# EAGLE design Plytka obw_wyjsciowych (EAGLE 4.11)
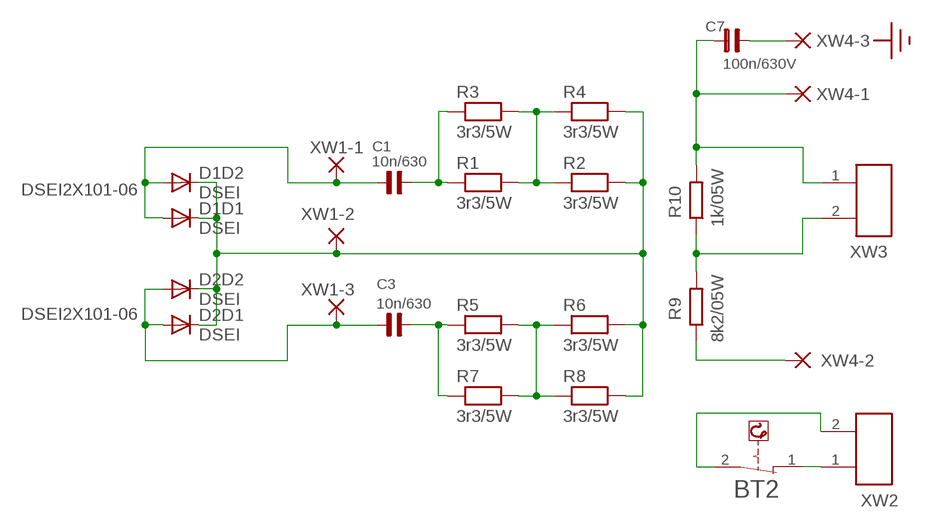
[diagram p0: schematic, sheet 1]

## Parts
BT2  TGRENZ  [TGRENZ]
C1  10n/630  C7,5B6  [C7,5B6]
C3  10n/630  C7,5B6  [C7,5B6]
C7  100n/630V  C27,5B9  [C27,5B9]
D1  DSEI  [SOT227]
D2  DSEI  [SOT227]
R1  3r3/5W  RPOWER5W  [RPOWER5W]
R2  3r3/5W  RPOWER5W  [RPOWER5W]
R3  3r3/5W  RPOWER5W  [RPOWER5W]
R4  3r3/5W  RPOWER5W  [RPOWER5W]
R5  3r3/5W  RPOWER5W  [RPOWER5W]
R6  3r3/5W  RPOWER5W  [RPOWER5W]
R7  3r3/5W  RPOWER5W  [RPOWER5W]
R8  3r3/5W  RPOWER5W  [RPOWER5W]
R9  8k2/05W  R-EU_0309/12  [0309/12]
R10  1k/05W  R-EU_0309/12  [0309/12]
XW1-1  PAD-0820  [0820]
XW1-2  PAD-0820  [0820]
XW1-3  PAD-0820  [0820]
XW2  ZK_2  [ZK_2]
XW3  ZK_2  [ZK_2]
XW4-1  PAD-0820  [0820]
XW4-2  PAD-0820  [0820]
XW4-3  PAD-0820  [0820]

## Nets
N$1: R1.2 R2.1 R3.2 R4.1
N$2: R5.2 R6.1 R7.2 R8.1
N$3: C1.2 R1.1 R3.1
N$5: C3.2 R5.1 R7.1
N$11: R9.1 XW4-2.P$1(P)
N$12: C7.1 R10.2 XW3.1 XW4-1.P$1(P)
N$13: C7.2 XW4-3.P$1(P)
N$14: BT2.1 XW2.1
N$15: R9.2 R10.1 XW3.2
N$16: BT2.2 XW2.2
N$20: C1.1 D1.A1(D1:A) D1.A2(D2:A) XW1-1.P$1(P)
N$21: C3.1 D2.A1(D1:A) D2.A2(D2:A) XW1-3.P$1(P)
QQQ: D1.K1(D1:C) D1.K2(D2:C) D2.K1(D1:C) D2.K2(D2:C) R2.2 R4.2 R6.2 R8.2 XW1-2.P$1(P)

## Notes on the sheet
- DSEI2X101-06
- DSEI2X101-06

## Library data of the parts
BT2 = ELEKTRIK:TGRENZ
C1 C3 = condensatory_2:C7,5B6
C7 = condensatory_2:C27,5B9
D1 D2 = diode:DSEI
R1-R8 = moje-elementy:RPOWER5W
R9 R10 = rcl:R-EU_: RESISTOR, European symbol
XW1-1-XW1-3 XW4-1-XW4-3 = dpads:PAD: WIRE PAD Standard US Drill Sizes and SMD pads
XW2 XW3 = moje-elementy:ZK_2

## Board
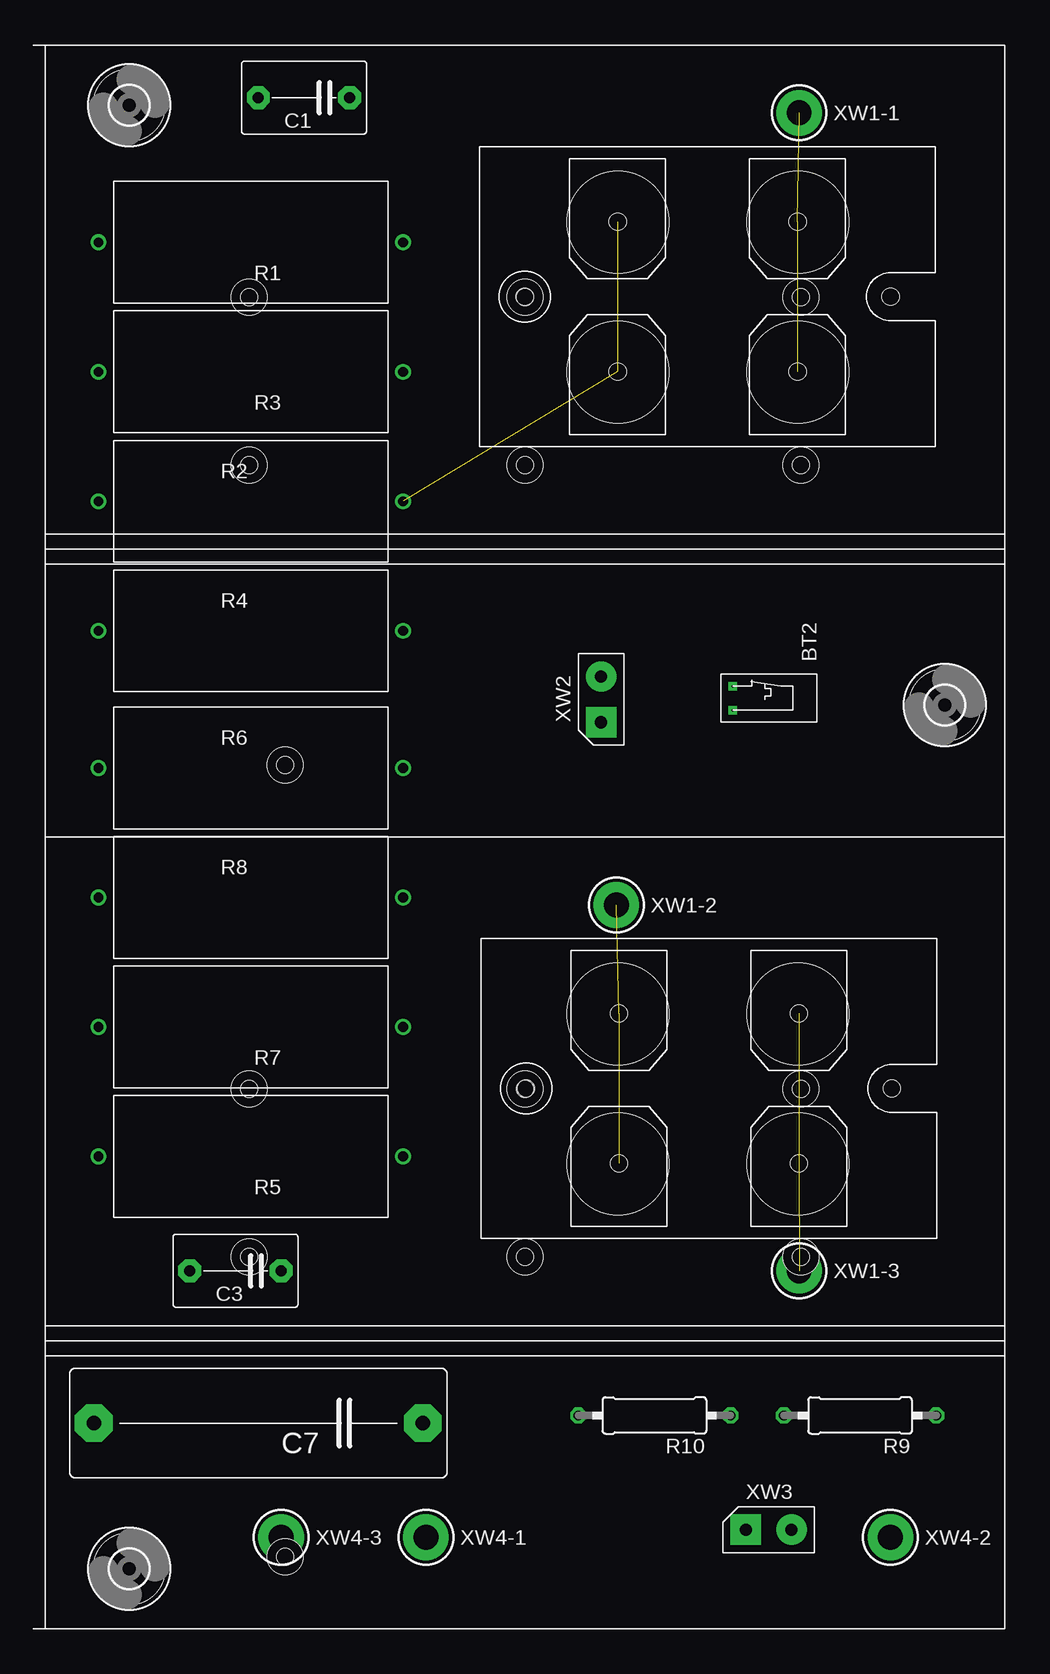
[diagram p1: board, top side]
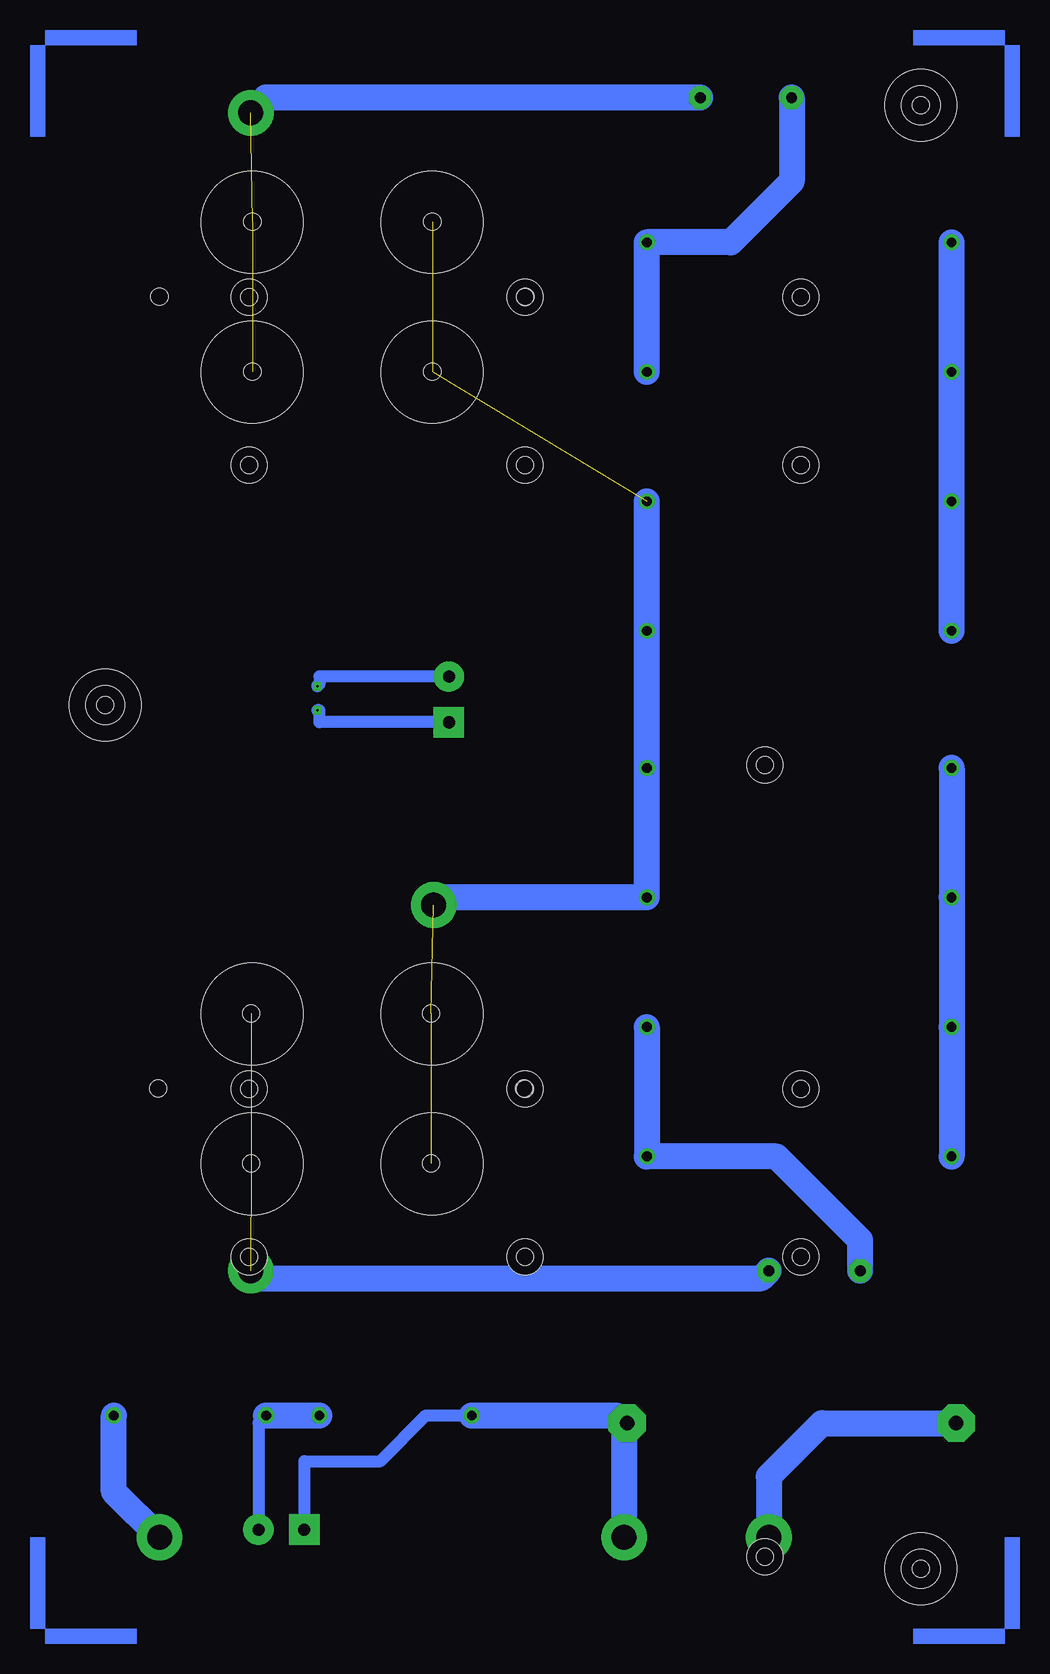
[diagram p2: board, bottom side, seen from below]

No outline drawn. Coordinates in mm, seen from the top.
Copper layers (1*16): Top 0.035mm / dielectric 1.5mm / Bottom 0.035mm
Design rules "default": minimum track width 10mil, minimum drill 24mil, track to track 8mil, track to pad 8mil, pad to pad 8mil, via to via 8mil, smd to smd 8mil, copper to edge 40mil, drill to drill 8mil, minimum pad ring 10mil, minimum via ring 8mil, stop-mask expansion 4mil, vias tented up to drill 0mil, thermal gap 10mil
Holes 8.5 mm at -32.25,117.25 -17.25,117.25 -32.25,104.75 -17.25,104.75 -32.25,51.25 -17.25,51.25 -32.25,38.75 -17.25,38.75
Holes 6 mm at -73,127 -73,5 -5,77
Holes 1.42 mm at -73,5 -5,77 -73,127

### Footprints (pad centres in the part's own frame; a part is rotated, then mirrored left to right if it is on the bottom)
TGRENZ = drill 0.2 pad 0.4 square: 1 1,3; 2 3,3
C7,5B6 = drill 0.914 pad 1.905 octagon: 1 -3.81,0; 2 3.81,0
C27,5B9 = drill 1.194 pad 3.15 octagon: 1 -13.716,0; 2 13.716,0
SOT227 = drill 4 round: A1 -7.5,-6.25; A2 -7.5,6.25; K1 7.5,-6.25; K2 7.5,6.25 | hole 1.422: 15.25,0; -15.25,0; -7.5,-6.25; -7.5,6.25; 7.5,6.25; 7.5,-6.25
RPOWER5W = drill 0.813 round: 1 -12.7,0; 2 12.7,0
0309/12 = drill 0.813 octagon: 1 -6.35,0; 2 6.35,0
RAD80X66 = hole 1.422: -17,21; -17,35; -40,21; -40,35; -63,21; -63,35; -20,60 | hole 3: -17,35; -17,21; -40,21; -63,21; -63,35; -40,35; -20,60
3,2 = hole 3.2: 0,0
0820 = drill 2.083 pad 3.81 round: P$1 0,0
ZK_2 = drill 1.016 pad 2.54 square: 1 -3.81,0 | drill 1.016 pad 2.54 round: 2 0,0

### Placement (x,y rotation side)
BT2  -19.68,75.56 90 top
C1  -58.42,127.64 180 top
C3  -64.14,29.84 180 top
C7  -62.23,17.14 180 top
D1  -24.78,111.04 180 top
D2  -24.66,45.04 180 top
R1  -62.87,115.57 180 top
R2  -62.87,93.98 0 top
R3  -62.87,104.78 180 top
R4  -62.87,83.19 0 top
R5  -62.87,39.37 180 top
R6  -62.87,71.75 0 top
R7  -62.87,50.16 180 top
R8  -62.87,60.96 0 top
R9  -12.06,17.78 180 top
R10  -29.21,17.78 180 top
U$1  [RAD80X66]  -80,66 180 top
U$2  [RAD80X66]  -80,132 180 top
U$3  [3,2]  -73,127 0 top
U$4  [3,2]  -5,77 0 top
U$5  [3,2]  -73,5 0 top
U$6  [ANGLE-ARROW-NW1]  -80,132 0 top
U$7  [ANGLE-ARROW-NW1]  0,132 270 top
U$8  [ANGLE-ARROW-NW1]  0,0 180 top
U$9  [ANGLE-ARROW-NW1]  -80,0 90 top
XW1-1  -17.14,126.36 0 top
XW1-2  -32.38,60.33 0 top
XW1-3  -17.14,29.84 0 top
XW2  -33.66,79.38 90 top
XW3  -17.78,8.26 0 top
XW4-1  -48.26,7.62 0 top
XW4-2  -9.53,7.62 0 top
XW4-3  -60.33,7.62 0 top

### Tracks (layer width: path | path; a pad name or v marks a point on that pad's centre or on a via)
N$1
  Bottom 2.184: R4.1 R2.1 R3.2 R1.2
N$2
  Bottom 2.184: R5.2 R7.2 R8.1 R6.1
N$3
  Bottom 2.184: R3.1 R1.1 -57.15,115.57 -62.23,120.65 C1.2
N$5
  Bottom 2.184: R7.1 R5.1 -60.96,39.37 -67.94,32.38 C3.2
N$11
  Bottom 2.184: XW4-2.P$1 -5.71,11.43 R9.1
N$12
  Bottom 1.016: XW3.1 -21.59,13.97 -27.94,13.97 -31.75,17.78 R10.2
  Bottom 2.184: -48.26,17.14 XW4-1.P$1 | -48.26,17.14 C7.1 | R10.2 -47.62,17.78 -48.26,17.14
N$13
  Bottom 2.184: C7.2 -64.77,17.14 -60.33,12.7 XW4-3.P$1
N$14
  Bottom 1.016: BT2.1 -22.86,76.56 -22.86,75.56 XW2.1
N$15
  Bottom 1.016: XW3.2 -17.78,17.14 R9.2
  Bottom 2.184: R9.2 R10.1
N$16
  Bottom 1.016: XW2.2 -22.86,79.38 -22.86,78.74 arc-90 BT2.2
N$20  (2 unrouted)
  Bottom 2.184: C1.1 -18.41,127.64 XW1-1.P$1
N$21  (2 unrouted)
  Bottom 2.184: XW1-3.P$1 -17.78,29.21 -59.69,29.21 C3.1
QQQ  (4 unrouted)
  Bottom 2.184: R2.2 R4.2 R6.2 R8.2 -33.02,60.96 XW1-2.P$1